# Altium schematic sheet cold-sample-board-rev2.SchDoc
size 762 x 520 mm; SheetNumber: 1; SheetTotal: 1
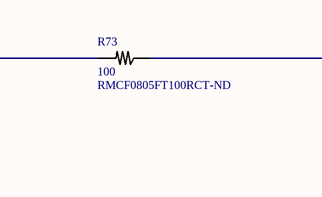
[diagram p0: cold-sample-board-rev2.SchDoc, top left]
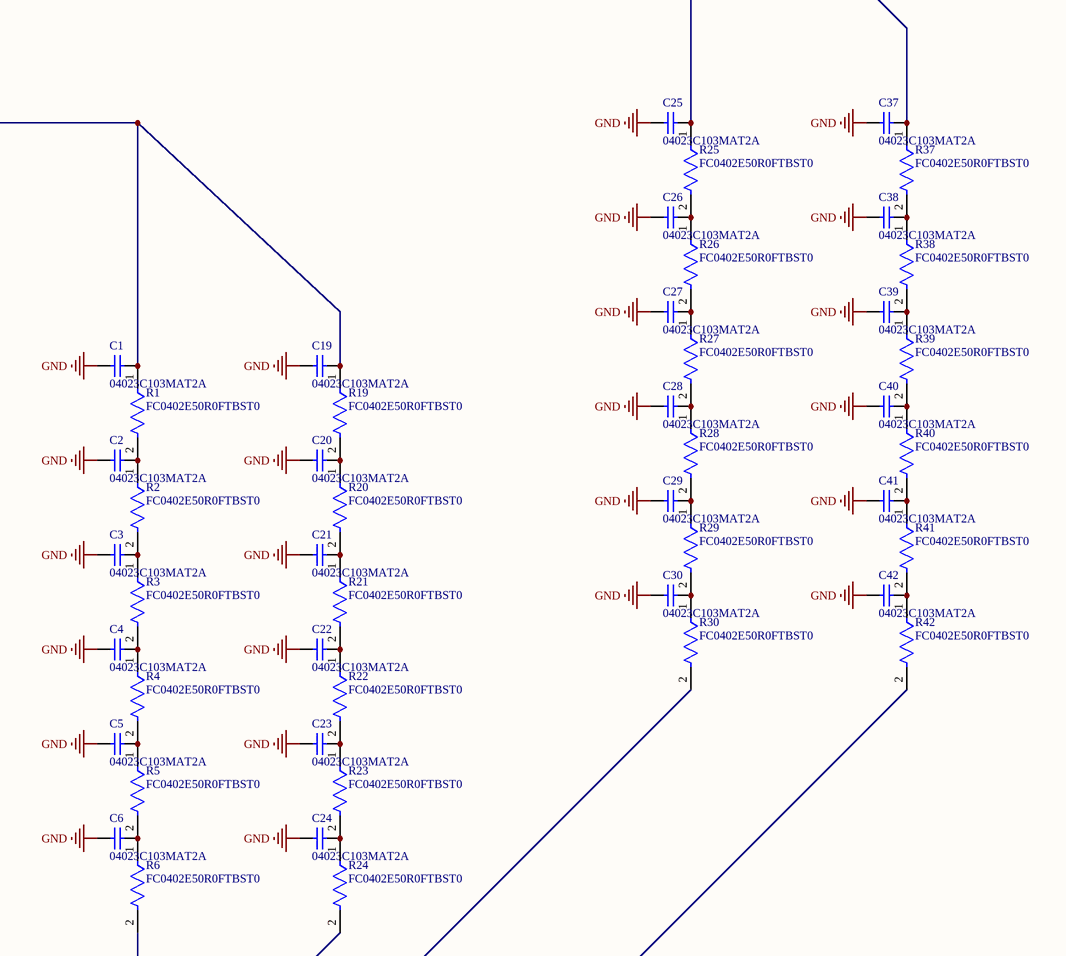
[diagram p1: cold-sample-board-rev2.SchDoc, top right]
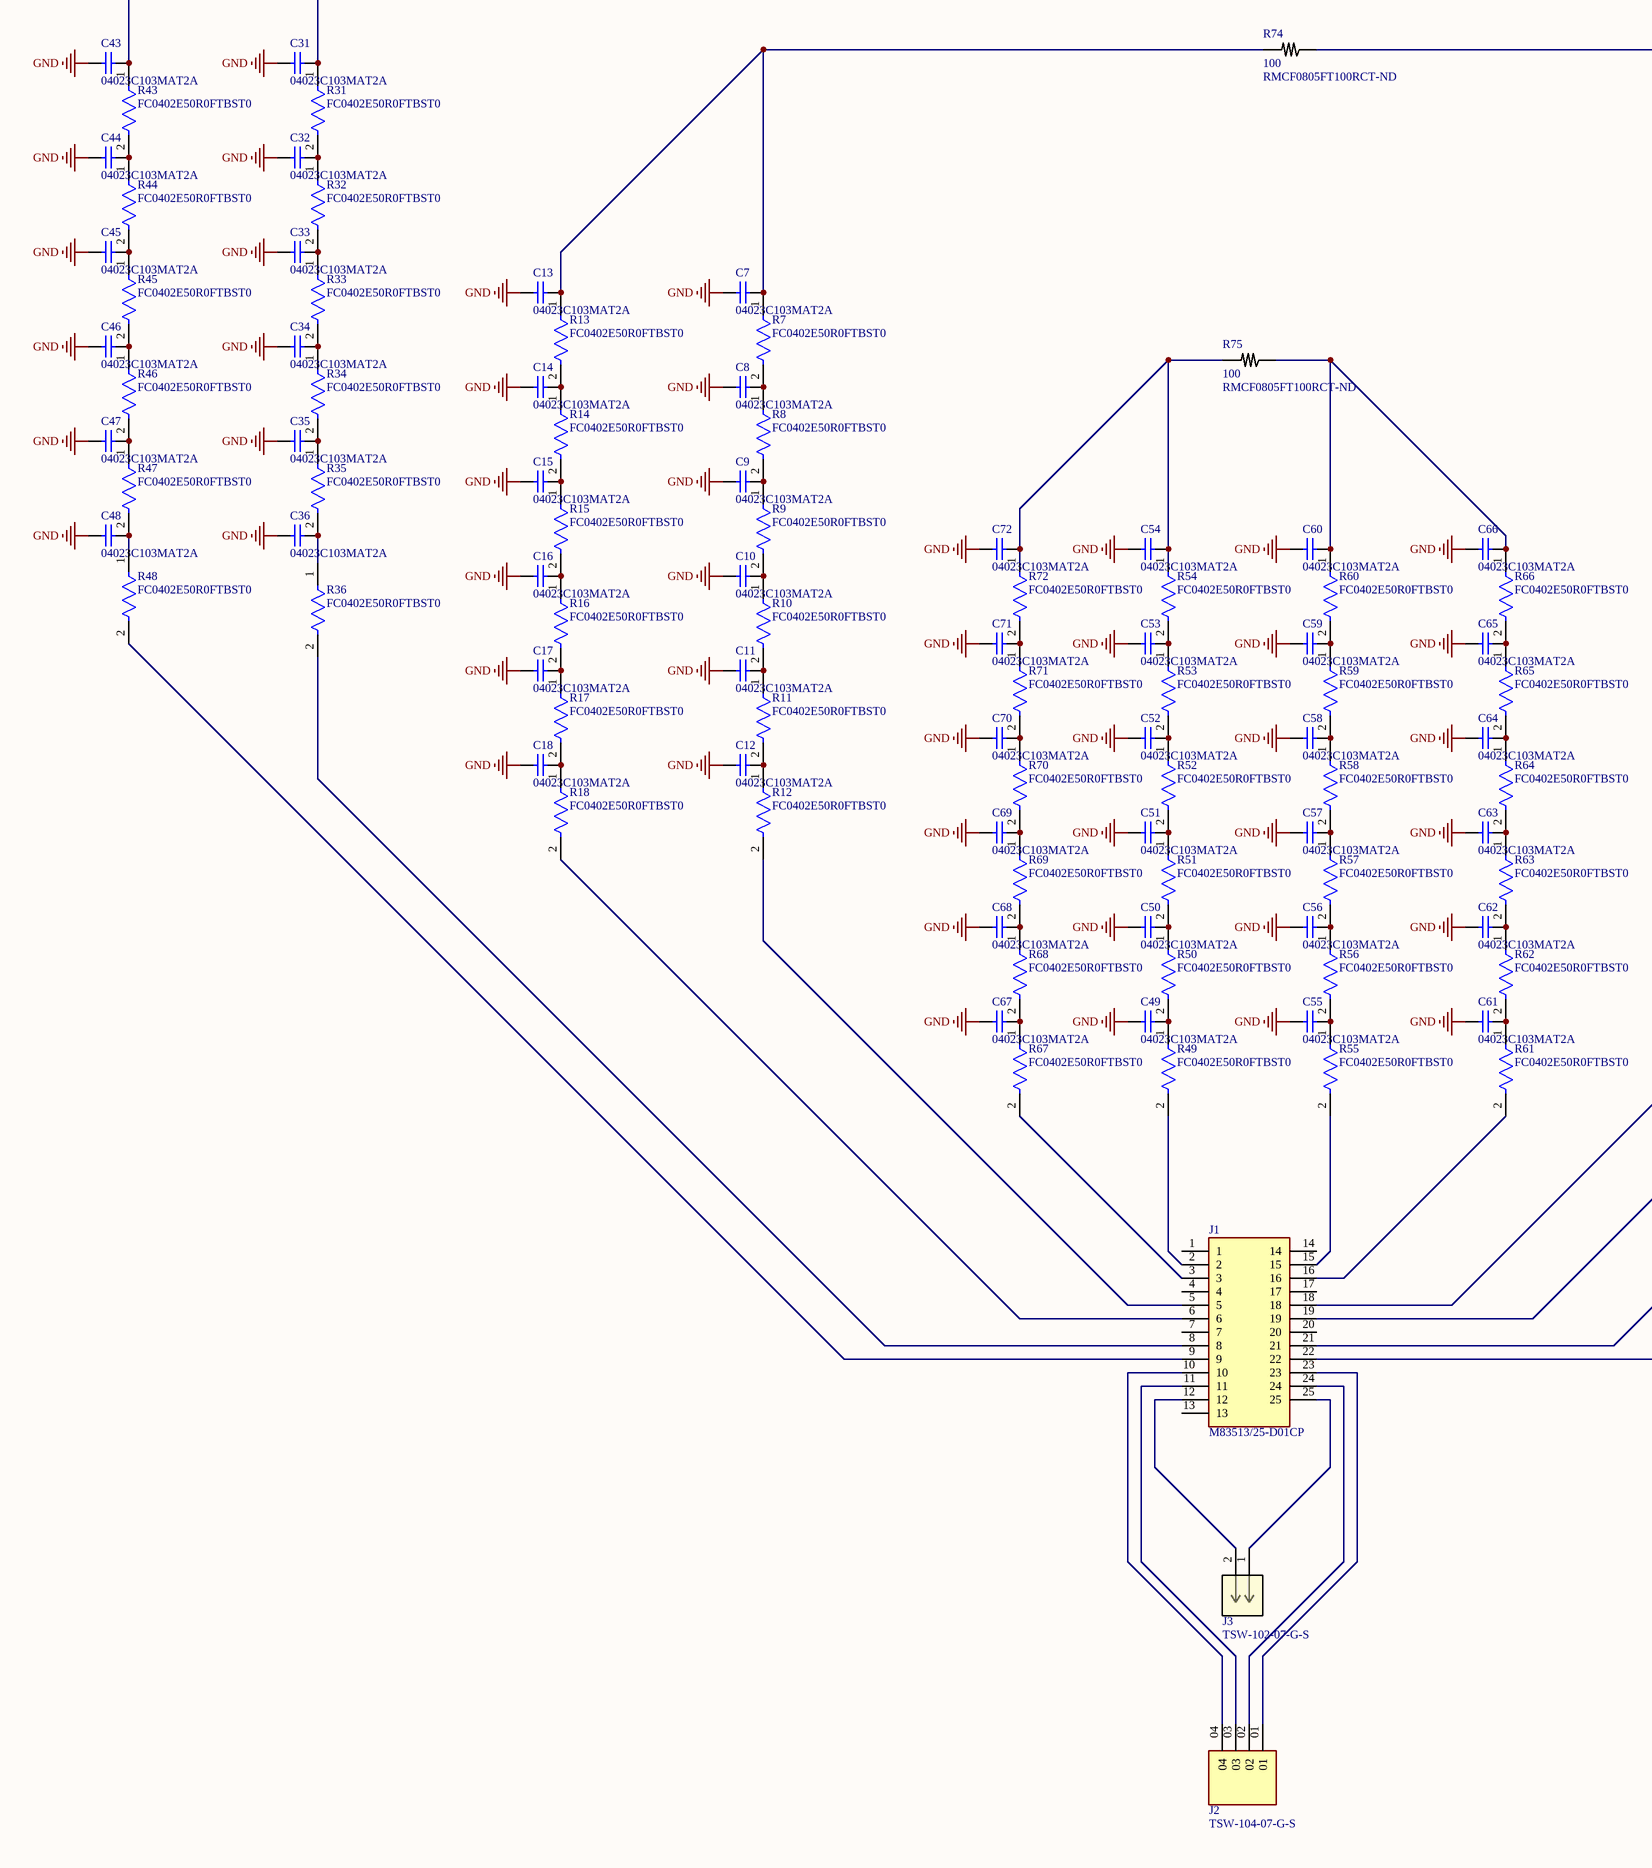
[diagram p2: cold-sample-board-rev2.SchDoc, bottom left]

## Parts
C1  04023C103MAT2A  [CAPC1005X56X25LL10T15]
C2  04023C103MAT2A  [CAPC1005X56X25LL10T15]
C3  04023C103MAT2A  [CAPC1005X56X25LL10T15]
C4  04023C103MAT2A  [CAPC1005X56X25LL10T15]
C5  04023C103MAT2A  [CAPC1005X56X25LL10T15]
C6  04023C103MAT2A  [CAPC1005X56X25LL10T15]
C7  04023C103MAT2A  [CAPC1005X56X25LL10T15]
C8  04023C103MAT2A  [CAPC1005X56X25LL10T15]
C9  04023C103MAT2A  [CAPC1005X56X25LL10T15]
C10  04023C103MAT2A  [CAPC1005X56X25LL10T15]
C11  04023C103MAT2A  [CAPC1005X56X25LL10T15]
C12  04023C103MAT2A  [CAPC1005X56X25LL10T15]
C13  04023C103MAT2A  [CAPC1005X56X25LL10T15]
C14  04023C103MAT2A  [CAPC1005X56X25LL10T15]
C15  04023C103MAT2A  [CAPC1005X56X25LL10T15]
C16  04023C103MAT2A  [CAPC1005X56X25LL10T15]
C17  04023C103MAT2A  [CAPC1005X56X25LL10T15]
C18  04023C103MAT2A  [CAPC1005X56X25LL10T15]
C19  04023C103MAT2A  [CAPC1005X56X25LL10T15]
C20  04023C103MAT2A  [CAPC1005X56X25LL10T15]
C21  04023C103MAT2A  [CAPC1005X56X25LL10T15]
C22  04023C103MAT2A  [CAPC1005X56X25LL10T15]
C23  04023C103MAT2A  [CAPC1005X56X25LL10T15]
C24  04023C103MAT2A  [CAPC1005X56X25LL10T15]
C25  04023C103MAT2A  [CAPC1005X56X25LL10T15]
C26  04023C103MAT2A  [CAPC1005X56X25LL10T15]
C27  04023C103MAT2A  [CAPC1005X56X25LL10T15]
C28  04023C103MAT2A  [CAPC1005X56X25LL10T15]
C29  04023C103MAT2A  [CAPC1005X56X25LL10T15]
C30  04023C103MAT2A  [CAPC1005X56X25LL10T15]
C31  04023C103MAT2A  [CAPC1005X56X25LL10T15]
C32  04023C103MAT2A  [CAPC1005X56X25LL10T15]
C33  04023C103MAT2A  [CAPC1005X56X25LL10T15]
C34  04023C103MAT2A  [CAPC1005X56X25LL10T15]
C35  04023C103MAT2A  [CAPC1005X56X25LL10T15]
C36  04023C103MAT2A  [CAPC1005X56X25LL10T15]
C37  04023C103MAT2A  [CAPC1005X56X25LL10T15]
C38  04023C103MAT2A  [CAPC1005X56X25LL10T15]
C39  04023C103MAT2A  [CAPC1005X56X25LL10T15]
C40  04023C103MAT2A  [CAPC1005X56X25LL10T15]
C41  04023C103MAT2A  [CAPC1005X56X25LL10T15]
C42  04023C103MAT2A  [CAPC1005X56X25LL10T15]
C43  04023C103MAT2A  [CAPC1005X56X25LL10T15]
C44  04023C103MAT2A  [CAPC1005X56X25LL10T15]
C45  04023C103MAT2A  [CAPC1005X56X25LL10T15]
C46  04023C103MAT2A  [CAPC1005X56X25LL10T15]
C47  04023C103MAT2A  [CAPC1005X56X25LL10T15]
C48  04023C103MAT2A  [CAPC1005X56X25LL10T15]
C49  04023C103MAT2A  [CAPC1005X56X25LL10T15]
C50  04023C103MAT2A  [CAPC1005X56X25LL10T15]
C51  04023C103MAT2A  [CAPC1005X56X25LL10T15]
C52  04023C103MAT2A  [CAPC1005X56X25LL10T15]
C53  04023C103MAT2A  [CAPC1005X56X25LL10T15]
C54  04023C103MAT2A  [CAPC1005X56X25LL10T15]
C55  04023C103MAT2A  [CAPC1005X56X25LL10T15]
C56  04023C103MAT2A  [CAPC1005X56X25LL10T15]
C57  04023C103MAT2A  [CAPC1005X56X25LL10T15]
C58  04023C103MAT2A  [CAPC1005X56X25LL10T15]
C59  04023C103MAT2A  [CAPC1005X56X25LL10T15]
C60  04023C103MAT2A  [CAPC1005X56X25LL10T15]
C61  04023C103MAT2A  [CAPC1005X56X25LL10T15]
C62  04023C103MAT2A  [CAPC1005X56X25LL10T15]
C63  04023C103MAT2A  [CAPC1005X56X25LL10T15]
C64  04023C103MAT2A  [CAPC1005X56X25LL10T15]
C65  04023C103MAT2A  [CAPC1005X56X25LL10T15]
C66  04023C103MAT2A  [CAPC1005X56X25LL10T15]
C67  04023C103MAT2A  [CAPC1005X56X25LL10T15]
C68  04023C103MAT2A  [CAPC1005X56X25LL10T15]
C69  04023C103MAT2A  [CAPC1005X56X25LL10T15]
C70  04023C103MAT2A  [CAPC1005X56X25LL10T15]
C71  04023C103MAT2A  [CAPC1005X56X25LL10T15]
C72  04023C103MAT2A  [CAPC1005X56X25LL10T15]
J1  M83513/25-D01CP  [BEL_M83513/25-D01CP]
J2  TSW-104-07-G-S  [SAMTEC_TSW-104-07-G-S]
J3  TSW-102-07-G-S  [CON2_1X2_TU_TSW]
R1  FC0402E50R0FTBST0  [FP-FC0402-MFG]
R2  FC0402E50R0FTBST0  [FP-FC0402-MFG]
R3  FC0402E50R0FTBST0  [FP-FC0402-MFG]
R4  FC0402E50R0FTBST0  [FP-FC0402-MFG]
R5  FC0402E50R0FTBST0  [FP-FC0402-MFG]
R6  FC0402E50R0FTBST0  [FP-FC0402-MFG]
R7  FC0402E50R0FTBST0  [FP-FC0402-MFG]
R8  FC0402E50R0FTBST0  [FP-FC0402-MFG]
R9  FC0402E50R0FTBST0  [FP-FC0402-MFG]
R10  FC0402E50R0FTBST0  [FP-FC0402-MFG]
R11  FC0402E50R0FTBST0  [FP-FC0402-MFG]
R12  FC0402E50R0FTBST0  [FP-FC0402-MFG]
R13  FC0402E50R0FTBST0  [FP-FC0402-MFG]
R14  FC0402E50R0FTBST0  [FP-FC0402-MFG]
R15  FC0402E50R0FTBST0  [FP-FC0402-MFG]
R16  FC0402E50R0FTBST0  [FP-FC0402-MFG]
R17  FC0402E50R0FTBST0  [FP-FC0402-MFG]
R18  FC0402E50R0FTBST0  [FP-FC0402-MFG]
R19  FC0402E50R0FTBST0  [FP-FC0402-MFG]
R20  FC0402E50R0FTBST0  [FP-FC0402-MFG]
R21  FC0402E50R0FTBST0  [FP-FC0402-MFG]
R22  FC0402E50R0FTBST0  [FP-FC0402-MFG]
R23  FC0402E50R0FTBST0  [FP-FC0402-MFG]
R24  FC0402E50R0FTBST0  [FP-FC0402-MFG]
R25  FC0402E50R0FTBST0  [FP-FC0402-MFG]
R26  FC0402E50R0FTBST0  [FP-FC0402-MFG]
R27  FC0402E50R0FTBST0  [FP-FC0402-MFG]
R28  FC0402E50R0FTBST0  [FP-FC0402-MFG]
R29  FC0402E50R0FTBST0  [FP-FC0402-MFG]
R30  FC0402E50R0FTBST0  [FP-FC0402-MFG]
R31  FC0402E50R0FTBST0  [FP-FC0402-MFG]
R32  FC0402E50R0FTBST0  [FP-FC0402-MFG]
R33  FC0402E50R0FTBST0  [FP-FC0402-MFG]
R34  FC0402E50R0FTBST0  [FP-FC0402-MFG]
R35  FC0402E50R0FTBST0  [FP-FC0402-MFG]
R36  FC0402E50R0FTBST0  [FP-FC0402-MFG]
R37  FC0402E50R0FTBST0  [FP-FC0402-MFG]
R38  FC0402E50R0FTBST0  [FP-FC0402-MFG]
R39  FC0402E50R0FTBST0  [FP-FC0402-MFG]
R40  FC0402E50R0FTBST0  [FP-FC0402-MFG]
R41  FC0402E50R0FTBST0  [FP-FC0402-MFG]
R42  FC0402E50R0FTBST0  [FP-FC0402-MFG]
R43  FC0402E50R0FTBST0  [FP-FC0402-MFG]
R44  FC0402E50R0FTBST0  [FP-FC0402-MFG]
R45  FC0402E50R0FTBST0  [FP-FC0402-MFG]
R46  FC0402E50R0FTBST0  [FP-FC0402-MFG]
R47  FC0402E50R0FTBST0  [FP-FC0402-MFG]
R48  FC0402E50R0FTBST0  [FP-FC0402-MFG]
R49  FC0402E50R0FTBST0  [FP-FC0402-MFG]
R50  FC0402E50R0FTBST0  [FP-FC0402-MFG]
R51  FC0402E50R0FTBST0  [FP-FC0402-MFG]
R52  FC0402E50R0FTBST0  [FP-FC0402-MFG]
R53  FC0402E50R0FTBST0  [FP-FC0402-MFG]
R54  FC0402E50R0FTBST0  [FP-FC0402-MFG]
R55  FC0402E50R0FTBST0  [FP-FC0402-MFG]
R56  FC0402E50R0FTBST0  [FP-FC0402-MFG]
R57  FC0402E50R0FTBST0  [FP-FC0402-MFG]
R58  FC0402E50R0FTBST0  [FP-FC0402-MFG]
R59  FC0402E50R0FTBST0  [FP-FC0402-MFG]
R60  FC0402E50R0FTBST0  [FP-FC0402-MFG]
R61  FC0402E50R0FTBST0  [FP-FC0402-MFG]
R62  FC0402E50R0FTBST0  [FP-FC0402-MFG]
R63  FC0402E50R0FTBST0  [FP-FC0402-MFG]
R64  FC0402E50R0FTBST0  [FP-FC0402-MFG]
R65  FC0402E50R0FTBST0  [FP-FC0402-MFG]
R66  FC0402E50R0FTBST0  [FP-FC0402-MFG]
R67  FC0402E50R0FTBST0  [FP-FC0402-MFG]
R68  FC0402E50R0FTBST0  [FP-FC0402-MFG]
R69  FC0402E50R0FTBST0  [FP-FC0402-MFG]
R70  FC0402E50R0FTBST0  [FP-FC0402-MFG]
R71  FC0402E50R0FTBST0  [FP-FC0402-MFG]
R72  FC0402E50R0FTBST0  [FP-FC0402-MFG]
R73  100  Supplier Part Number 1: RMCF0805FT100RCT-ND  [6-0805]
R74  100  Supplier Part Number 1: RMCF0805FT100RCT-ND  [6-0805]
R75  100  Supplier Part Number 1: RMCF0805FT100RCT-ND  [6-0805]

## Nets
GND: C1.1 C2.1 C3.1 C4.1 C5.1 C6.1 C7.1 C8.1 C9.1 C10.1 C11.1 C12.1 C13.1 C14.1 C15.1 C16.1 C17.1 C18.1 C19.1 C20.1 C21.1 C22.1 C23.1 C24.1 C25.1 C26.1 C27.1 C28.1 C29.1 C30.1 C31.1 C32.1 C33.1 C34.1 C35.1 C36.1 C37.1 C38.1 C39.1 C40.1 C41.1 C42.1 C43.1 C44.1 C45.1 C46.1 C47.1 C48.1 C49.1 C50.1 C51.1 C52.1 C53.1 C54.1 C55.1 C56.1 C57.1 C58.1 C59.1 C60.1 C61.1 C62.1 C63.1 C64.1 C65.1 C66.1 C67.1 C68.1 C69.1 C70.1 C71.1 C72.1
NetC1_2: C1.2 C19.2 R1.1 R19.1 R74.1
NetC2_2: C2.2 R1.2 R2.1
NetC3_2: C3.2 R2.2 R3.1
NetC4_2: C4.2 R3.2 R4.1
NetC5_2: C5.2 R4.2 R5.1
NetC6_2: C6.2 R5.2 R6.1
NetC7_2: C7.2 C13.2 R7.1 R13.1 R74.2
NetC8_2: C8.2 R7.2 R8.1
NetC9_2: C9.2 R8.2 R9.1
NetC10_2: C10.2 R9.2 R10.1
NetC11_2: C11.2 R10.2 R11.1
NetC12_2: C12.2 R11.2 R12.1
NetC14_2: C14.2 R13.2 R14.1
NetC15_2: C15.2 R14.2 R15.1
NetC16_2: C16.2 R15.2 R16.1
NetC17_2: C17.2 R16.2 R17.1
NetC18_2: C18.2 R17.2 R18.1
NetC20_2: C20.2 R19.2 R20.1
NetC21_2: C21.2 R20.2 R21.1
NetC22_2: C22.2 R21.2 R22.1
NetC23_2: C23.2 R22.2 R23.1
NetC24_2: C24.2 R23.2 R24.1
NetC25_2: C25.2 C37.2 R25.1 R37.1 R73.1
NetC26_2: C26.2 R25.2 R26.1
NetC27_2: C27.2 R26.2 R27.1
NetC28_2: C28.2 R27.2 R28.1
NetC29_2: C29.2 R28.2 R29.1
NetC30_2: C30.2 R29.2 R30.1
NetC31_2: C31.2 C43.2 R31.1 R43.1 R73.2
NetC32_2: C32.2 R31.2 R32.1
NetC33_2: C33.2 R32.2 R33.1
NetC34_2: C34.2 R33.2 R34.1
NetC35_2: C35.2 R34.2 R35.1
NetC36_2: C36.2 R35.2 R36.1
NetC38_2: C38.2 R37.2 R38.1
NetC39_2: C39.2 R38.2 R39.1
NetC40_2: C40.2 R39.2 R40.1
NetC41_2: C41.2 R40.2 R41.1
NetC42_2: C42.2 R41.2 R42.1
NetC44_2: C44.2 R43.2 R44.1
NetC45_2: C45.2 R44.2 R45.1
NetC46_2: C46.2 R45.2 R46.1
NetC47_2: C47.2 R46.2 R47.1
NetC48_2: C48.2 R47.2 R48.1
NetC49_2: C49.2 R49.1 R50.2
NetC50_2: C50.2 R50.1 R51.2
NetC51_2: C51.2 R51.1 R52.2
NetC52_2: C52.2 R52.1 R53.2
NetC53_2: C53.2 R53.1 R54.2
NetC54_2: C54.2 C72.2 R54.1 R72.1 R75.2
NetC55_2: C55.2 R55.1 R56.2
NetC56_2: C56.2 R56.1 R57.2
NetC57_2: C57.2 R57.1 R58.2
NetC58_2: C58.2 R58.1 R59.2
NetC59_2: C59.2 R59.1 R60.2
NetC60_2: C60.2 C66.2 R60.1 R66.1 R75.1
NetC61_2: C61.2 R61.1 R62.2
NetC62_2: C62.2 R62.1 R63.2
NetC63_2: C63.2 R63.1 R64.2
NetC64_2: C64.2 R64.1 R65.2
NetC65_2: C65.2 R65.1 R66.2
NetC67_2: C67.2 R67.1 R68.2
NetC68_2: C68.2 R68.1 R69.2
NetC69_2: C69.2 R69.1 R70.2
NetC70_2: C70.2 R70.1 R71.2
NetC71_2: C71.2 R71.1 R72.2
NetJ1_2: J1.2 R49.2
NetJ1_3: J1.3 R67.2
NetJ1_5: J1.5 R12.2
NetJ1_6: J1.6 R18.2
NetJ1_8: J1.8 R36.2
NetJ1_9: J1.9 R48.2
NetJ1_10: J1.10 J2.04
NetJ1_11: J1.11 J2.03
NetJ1_12: J1.12 J3.2
NetJ1_15: J1.15 R55.2
NetJ1_16: J1.16 R61.2
NetJ1_18: J1.18 R6.2
NetJ1_19: J1.19 R24.2
NetJ1_21: J1.21 R30.2
NetJ1_22: J1.22 R42.2
NetJ1_23: J1.23 J2.01
NetJ1_24: J1.24 J2.02
NetJ1_25: J1.25 J3.1

Not connected (* = marked no-connect by the designer): J1 1 4 7 13 14 17 20

## Library data of the parts
C1-C72 = CMP-2008-02518-1: Manufacturer: AVX Interconnect / Elco; Part Number: 04023C103MAT2A
J1 = M83513/25-D01CP: MIL-DTL-83513 PCB Mounted Connector | Socket | 25 Positions | Shell Finish - Cadmium | Female | PCB Solder Pins | 0.109" (2.77 mm) Pin Length; Package: None; Price: None; Value: *; MP: M83513/25-D01CP; Availability: Unavailable
J2 = TSW-104-07-G-S: <a href="https://pricing.snapeda.com/parts/TSW-104-07-G-S/Samtec/view-part?ref=eda">Check availability</a>; MP: altium_native_batch; Package: None; Price: None; Value: *; Availability: Unavailable
J3 = TSW-102-07-G-S: No Description Available; Mfr_Name: Samtec Inc; Copyright: Copyright (C) 2024 Ultra Librarian. All rights reserved.; Manufacturer_Part_Number: TSW-102-07-G-S; RefDes: RefDes; Type: DEV
R1-R72 = CMP-00030-23258606-1: FC0402E50R0FTBST0 SMD Chip Resistor, 50 Ohm, ± 1%, 50 mW, 0402 [1005 Metric], Thin Film, High Frequency; Temperature Coefficient: 25ppm/°C; Resistance: 50Ω; Voltage Rating: 30V; Power Rating: 50mW; Depth: 510µm; Case/Package: 0402; NexarPartId: 23258606; RoHS: Compliant; Termination: SMD/SMT; Min Operating Temperature: -55°C; Military Standard: Not; Length: 1.016mm; Max Operating Temperature: 125°C; Mount: Surface Mount; Height: 381µm; Radiation Hardening: No; Packaging: Tape and Reel; Tolerance: 1%; Composition: Thin Film
R73-R75 = 100 ohm 0805: RES 100 OHM 1% 1/8W 0805; Supplier 1: Digi-Key